# Altium schematic sheet Peripherals.SchDoc
size A3; SheetNumber: 2; SheetTotal: 3
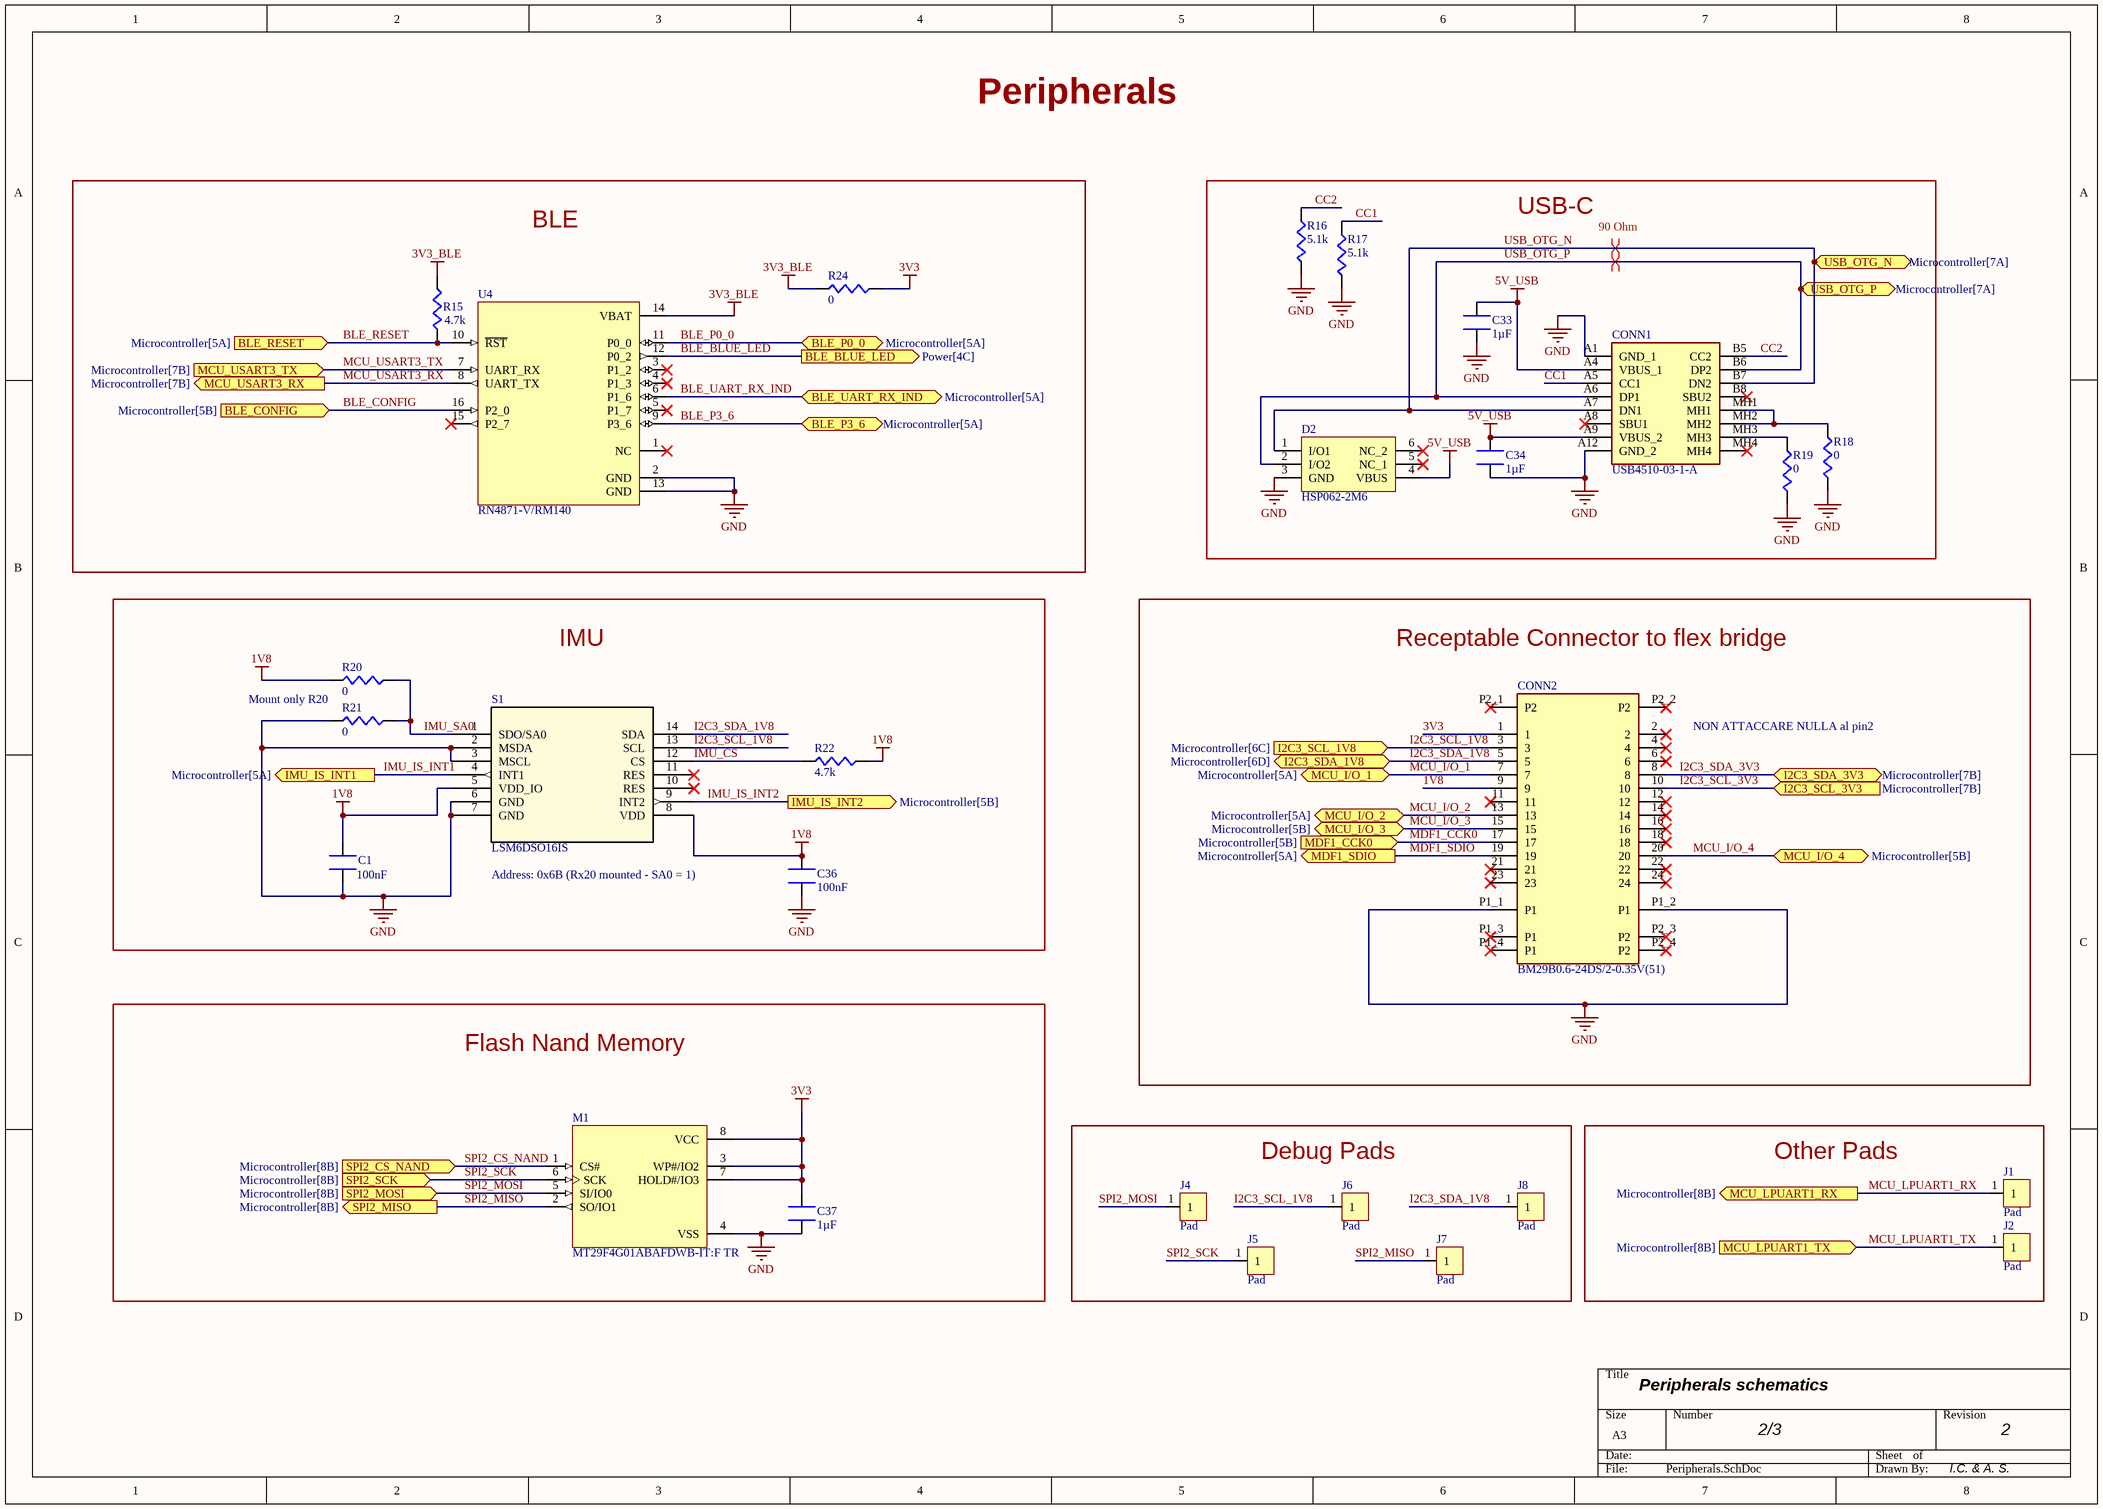
[diagram p0: Peripherals.SchDoc]

## Parts
C1  value 100nF  [Chip2PinSM127P600-8N]  (hidden comment: 0201ZD104KAT2A)
C33  value 1µF  [Chip2PinSM127P600-8N]  (hidden comment: CL03A105KP3NSNC)
C34  value 1µF  [Chip2PinSM127P600-8N]  (hidden comment: CL03A105KP3NSNC)
C36  value 100nF  [Chip2PinSM127P600-8N]  (hidden comment: 0201ZD104KAT2A)
C37  value 1µF  [Chip2PinSM127P600-8N]  (hidden comment: CL03A105KP3NSNC)
CONN1  USB4510-03-1-A  [USB4510-03-1-A-Footprint-1]
CONN2  BM29B0.6-24DS/2-0.35V(51)  [BM29B0.6-24DS_2-0.35V(51)-Footprint-1]
D2  HSP062-2M6  [HSP062-2M6-Footprint-1]
J1  Pad  [Pad-Footprint-1]  (no BOM)
J2  Pad  [Pad-Footprint-1]  (no BOM)
J4  Pad  [Pad-Footprint-1]  (no BOM)
J5  Pad  [Pad-Footprint-1]  (no BOM)
J6  Pad  [Pad-Footprint-1]  (no BOM)
J7  Pad  [Pad-Footprint-1]  (no BOM)
J8  Pad  [Pad-Footprint-1]  (no BOM)
M1  MT29F4G01ABAFDWB-IT:F TR  [MT29F4G01ABAFDWB-IT:F TR-Footprint-1]
R15  value 4.7k  [RESC1005X04N]  (hidden comment: CRCW04024K70FKED)
R16  value 5.1k  [Chip2PinSM127P600-8N]  (hidden comment: ERJ-1GNF5101C)
R17  value 5.1k  [Chip2PinSM127P600-8N]  (hidden comment: ERJ-1GNF5101C)
R18  value 0  [Chip2PinSM127P600-8N]  (hidden comment: CRCW02010000Z0ED)
R19  value 0  [Chip2PinSM127P600-8N]  (hidden comment: CRCW02010000Z0ED)
R20  value 0  [Chip2PinSM127P600-8N]  (hidden comment: CRCW02010000Z0ED)
R21  value 0  [Chip2PinSM127P600-8N]  (hidden comment: CRCW02010000Z0ED)
R22  value 4.7k  [Chip2PinSM127P600-8N]  (hidden comment: CR0201-JW-472GLF)
R24  value 0  [Chip2PinSM127P600-8N]  (hidden comment: CRCW02010000Z0ED)
S1  LSM6DSO16IS  [LSM6DSO16IS-Footprint-1]
U4  RN4871-V/RM140  [RN4871-V_RM118-Footprint-1]

## Blocks framed on the sheet
BLE: R15 R24 U4
USB-C: C33 C34 CONN1 D2 R16-R19
IMU: C1 C36 R20-R22 S1
Receptable Connector to flex bridge: CONN2
Flash Nand Memory: C37 M1
Debug Pads: J4-J8
Other Pads: J1 J2

## Ports
BLE_BLUE_LED (out, see Power[4C]), BLE_CONFIG (in, see Microcontroller[5B]), BLE_P0_0 (bidir, see Microcontroller[5A]), BLE_P3_6 (bidir, see Microcontroller[5A]), BLE_RESET (in, see Microcontroller[5A]), BLE_UART_RX_IND (bidir, see Microcontroller[5A]), I2C3_SCL_1V8 (in, see Microcontroller[6C]), I2C3_SCL_3V3 (in, see Microcontroller[7B]), I2C3_SDA_1V8 (bidir, see Microcontroller[6D]), I2C3_SDA_3V3 (bidir, see Microcontroller[7B]), IMU_IS_INT1 (out, see Microcontroller[5A]), IMU_IS_INT2 (out, see Microcontroller[5B]), MCU_I/O_1 (bidir, see Microcontroller[5A]), MCU_I/O_2 (bidir, see Microcontroller[5A]), MCU_I/O_3 (bidir, see Microcontroller[5B]), MCU_I/O_4 (bidir, see Microcontroller[5B]), MCU_LPUART1_RX (out, see Microcontroller[8B]), MCU_LPUART1_TX (in, see Microcontroller[8B]), MCU_USART3_RX (out, see Microcontroller[7B]), MCU_USART3_TX (in, see Microcontroller[7B]), MDF1_CCK0 (in, see Microcontroller[5B]), MDF1_SDIO (out, see Microcontroller[5A]), SPI2_CS_NAND (in, see Microcontroller[8B]), SPI2_MISO (out, see Microcontroller[8B]), SPI2_MOSI (in, see Microcontroller[8B]), SPI2_SCK (in, see Microcontroller[8B]), USB_OTG_N (bidir, see Microcontroller[7A]), USB_OTG_P (bidir, see Microcontroller[7A])

## Nets
1V8: C1.2 C36.2 CONN2.9 R20.1 R22.2 S1.5(VDD_IO) S1.8(VDD)
3V3: C37.2 CONN2.1 M1.3(WP#/IO2) M1.7(HOLD#/IO3) M1.8(VCC) R24.2
3V3_BLE: R15.2 R24.1 U4.14(VBAT)
5V_USB: C33.2 C34.2 CONN1.A4(VBUS_1) CONN1.A9(VBUS_2) D2.4(VBUS)
GND: C1.1 C33.1 C34.1 C36.1 C37.1 CONN1.A1(GND_1) CONN1.A12(GND_2) CONN2.P1_1(P1) CONN2.P1_2(P1) D2.3(GND) M1.4(VSS) R16.1 R17.1 R18.1 R19.1 R21.1 S1.2(MSDA) S1.3(MSCL) S1.6(GND) S1.7(GND) U4.2(GND) U4.13(GND)
BLE_BLUE_LED: U4.12(P0_2) ; port BLE_BLUE_LED
BLE_CONFIG: U4.16(P2_0) ; port BLE_CONFIG
BLE_P0_0: U4.11(P0_0) ; port BLE_P0_0
BLE_P3_6: U4.9(P3_6) ; port BLE_P3_6
BLE_RESET: R15.1 U4.10(~{RST}) ; port BLE_RESET
BLE_UART_RX_IND: U4.6(P1_6) ; port BLE_UART_RX_IND
CC1: CONN1.A5(CC1) R17.2
CC2: CONN1.B5(CC2) R16.2
I2C3_SCL_1V8: CONN2.3 J6.1 S1.13(SCL) ; port I2C3_SCL_1V8
I2C3_SCL_3V3: CONN2.10 ; port I2C3_SCL_3V3
I2C3_SDA_1V8: CONN2.5 J8.1 S1.14(SDA) ; port I2C3_SDA_1V8
I2C3_SDA_3V3: CONN2.8 ; port I2C3_SDA_3V3
IMU_CS: R22.1 S1.12(CS)
IMU_IS_INT1: S1.4(INT1) ; port IMU_IS_INT1
IMU_IS_INT2: S1.9(INT2) ; port IMU_IS_INT2
IMU_SA0: R20.2 R21.2 S1.1(SDO/SA0)
MCU_I/O_1: CONN2.7 ; port MCU_I/O_1
MCU_I/O_2: CONN2.13 ; port MCU_I/O_2
MCU_I/O_3: CONN2.15 ; port MCU_I/O_3
MCU_I/O_4: CONN2.20 ; port MCU_I/O_4
MCU_LPUART1_RX: J1.1 ; port MCU_LPUART1_RX
MCU_LPUART1_TX: J2.1 ; port MCU_LPUART1_TX
MCU_USART3_RX: U4.8(UART_TX) ; port MCU_USART3_RX
MCU_USART3_TX: U4.7(UART_RX) ; port MCU_USART3_TX
MDF1_CCK0: CONN2.17 ; port MDF1_CCK0
MDF1_SDIO: CONN2.19 ; port MDF1_SDIO
SPI2_CS_NAND: M1.1(CS#) ; port SPI2_CS_NAND
SPI2_MISO: J7.1 M1.2(SO/IO1) ; port SPI2_MISO
SPI2_MOSI: J4.1 M1.5(SI/IO0) ; port SPI2_MOSI
SPI2_SCK: J5.1 M1.6(SCK) ; port SPI2_SCK
USB_OTG_N: CONN1.A7(DN1) CONN1.B7(DN2) D2.1(I/O1) ; port USB_OTG_N
USB_OTG_P: CONN1.A6(DP1) CONN1.B6(DP2) D2.2(I/O2) ; port USB_OTG_P
NetCONN1_MH1: CONN1.MH1 CONN1.MH2 R18.2
NetCONN1_MH3: CONN1.MH3 R19.2

Not connected (* = marked no-connect by the designer): CONN1 A8(SBU1)* B8(SBU2)* MH4*; CONN2 2* 4* 6* 11* 12* 14* 16* 18* 21* 22* 23* 24* P1_3(P1)* P1_4(P1)* P2_1(P2)* P2_2(P2)* P2_3(P2)* P2_4(P2)*; D2 5(NC_1)* 6(NC_2)*; S1 10(RES)* 11(RES)*; U4 1(NC)* 3(P1_2)* 4(P1_3)* 5(P1_7)* 15(P2_7)*

## Layout directives
differential pair: USB_OTG_N, USB_OTG_P

## Notes on the sheet
- Peripherals
- 90 Ohm
- Mount only R20
- NON ATTACCARE NULLA al pin2
- Address: 0x6B (Rx20 mounted - SA0 = 1)
- Peripherals schematics
- 2/3
- 2
- I.C. & A. S.

## Library data of the parts
C1 C36 = CMP-00064-2: Ceramic Capacitor, Non-polarized, Multilayer, Ceramic, 10V, 10% +Tol, 10% -Tol, X5R, 15% TC, 0.1uF, Surface Mount, 0201; Multilayer: Yes; Length: 0.6mm; Packaging: Tape and Reel; Reach SVHC Compliant: Yes; Height: 0.33mm; Min Operating Temperature: -55°C; Tolerance  (fill in as +-): 10%; Tolerance (fill in as +-): 10%; Package Style: SMTMeter; Mounting Technology: Surface Mount; Case/Package: 0201; Terminal Finish: Nickel; Dielectric Material: Ceramic; RoHS Compliant: Yes; Capacitor Type: Ceramic; JESD-609 Code: e3; Rated DC Voltage (URdc): 10V; Width: 0.3mm; Termination: Wraparound; Max Operating Temperature: 85°C; Pins: 2; Package Shape: Rectangular; Temperature Characteristics Code: X5R
C33 C34 C37 = CMP-001-00095-4: Ceramic Capacitor, Multilayer, Ceramic, 10V, 10% +Tol, 10% -Tol, X5R, 15% TC, 1uF, Surface Mount, 0201; Min Operating Temperature: -55°C; Capacitor Type: Ceramic; Pins: 2; Max Operating Temperature: 85°C; Mounting Technology: Surface Mount; Case/Package: 0201; RoHS Compliant: Yes
CONN1 = CMP-00137-10: Connettori USB USB C Rec 16P 3u" Mid Mnt 1.6mm O-set SMT L = 6.5mm S-Spring
CONN2 = CMP-002-00106-1: Connector Receptacle 26 Pos (24+2) SMD
D2 = CMP-004-00031-2: TVS DIODE 3VWM 18VC 6UQFN / ESD Suppressor Diode Array Uni-Dir 3V 6-Pin UQFN T/R
J1 J2 J4-J8 = CMP-002-00075-4: Pad to connect external electrodes or sensors. Choose the right footprint.
M1 = CMP-019-00055-3: Active Non-Volatile SPI FLASH ic memory -40C~85C TA 2.7V~3.6V 4Gb 4G x 1
R15 = CMP-009-00183-1: SMD Chip Resistor, 4.7 kOhm, ± 1%, 63 mW, 0402 [1005 Metric], Thick Film, General Purpose
R16 R17 = CMP-009-00205-1: Fixed Resistor, Metal Glaze/thick Film, 0.05W, 5100ohm, 25V, 1% +/-Tol, 200ppm/Cel, Surface Mount, 0201; Power: 50mW; Case/Package: 0201; Pins: 2; RoHS Compliant: Yes; Min Operating Temperature: -55°C; Tolerance: 1%; Max Operating Temperature: 125°C; Mounting Technology: Surface Mount
R18-R21 R24 = CMP-00081-1: Fixed Resistor, Metal Glaze/thick Film, 0.05W, 0ohm, Surface Mount, 0201; Package Length: 0.6mm; Power: 50mW; Rated Temperature: 70°C; Package Width: 0.3mm; Package Height: 0.23mm; Reference Standard: AEC-Q200; Terminal Finish: Nickel; Pins: 2; Package Shape: Rectangular; Resistor Type: FIXED RESISTOR; Max Operating Temperature: 155°C; Min Operating Temperature: -55°C; JESD-609 Code: e3; Mounting Technology: Surface Mount; Termination: Wraparound; Package Style: SMTMeter; RoHS Compliant: Yes; Case/Package: 0201; Construction: Chip; Reach SVHC Compliant: Yes; Technology: METAL GLAZE/THICK FILM; Packaging: Tape and Reel
R22 = CMP-00117-1: Fixed Resistor, Metal Glaze/thick Film, 0.05W, 4700ohm, 30V, 5% +/-Tol, 200ppm/Cel, Surface Mount, 0201; Temperature Coefficient: 200ppm/°C; Working Voltage: 25V; Rated Temperature: 70°C; Package Height: 0.23mm; Power: 50mW; Package Width: 0.3mm; Package Length: 0.6mm; Max Operating Temperature: 125°C; Construction: Chip; Technology: RUTHENIUM OXIDE; Min Operating Temperature: -55°C; Terminal Finish: Nickel; Packaging: Tape and Reel; Pins: 2; Tolerance: 5%; Termination: Wraparound; Package Style: SMTMeter; Reach SVHC Compliant: Yes; Mounting Technology: Surface Mount; Package Shape: Rectangular; JESD-609 Code: e3; Case/Package: 0201; Resistor Type: FIXED RESISTOR; RoHS Compliant: Yes
S1 = CMP-010-00025-7: IMU 6-axis with Intelligent Sensor Process Unit
U4 = CMP-00025-00003-6: Bluetooth Modules - 802.15.1 Bluetooth Low Energy BLE Module, Shielded, Antenna, ASCII Interface, 9x11.5mm